# Altium schematic sheet Sheet1.SchDoc
size A4; SheetNumber: 1; SheetTotal: 1; SPICEModelCacheHBWIFJJK: <root> / <DocumentId>HBWIFJJK</DocumentId> / <CacheFrame Number="0"> / <Model Name="led0" Kind="MDL"> / <Text>*Typ INFRARED GaAs LED: Vf=1.2V Vr=5V If=40mA trr=3uS / *LED Pinout: 1=A, 2=K / .MODEL LED0 D (IS=93.5P RS=84M N=2.63 BV=5 IBV=10U / + CJO=2.97P VJ=.75 M=.333 TT=4.32U)</Text> / </Model> / </CacheFrame> / </root>
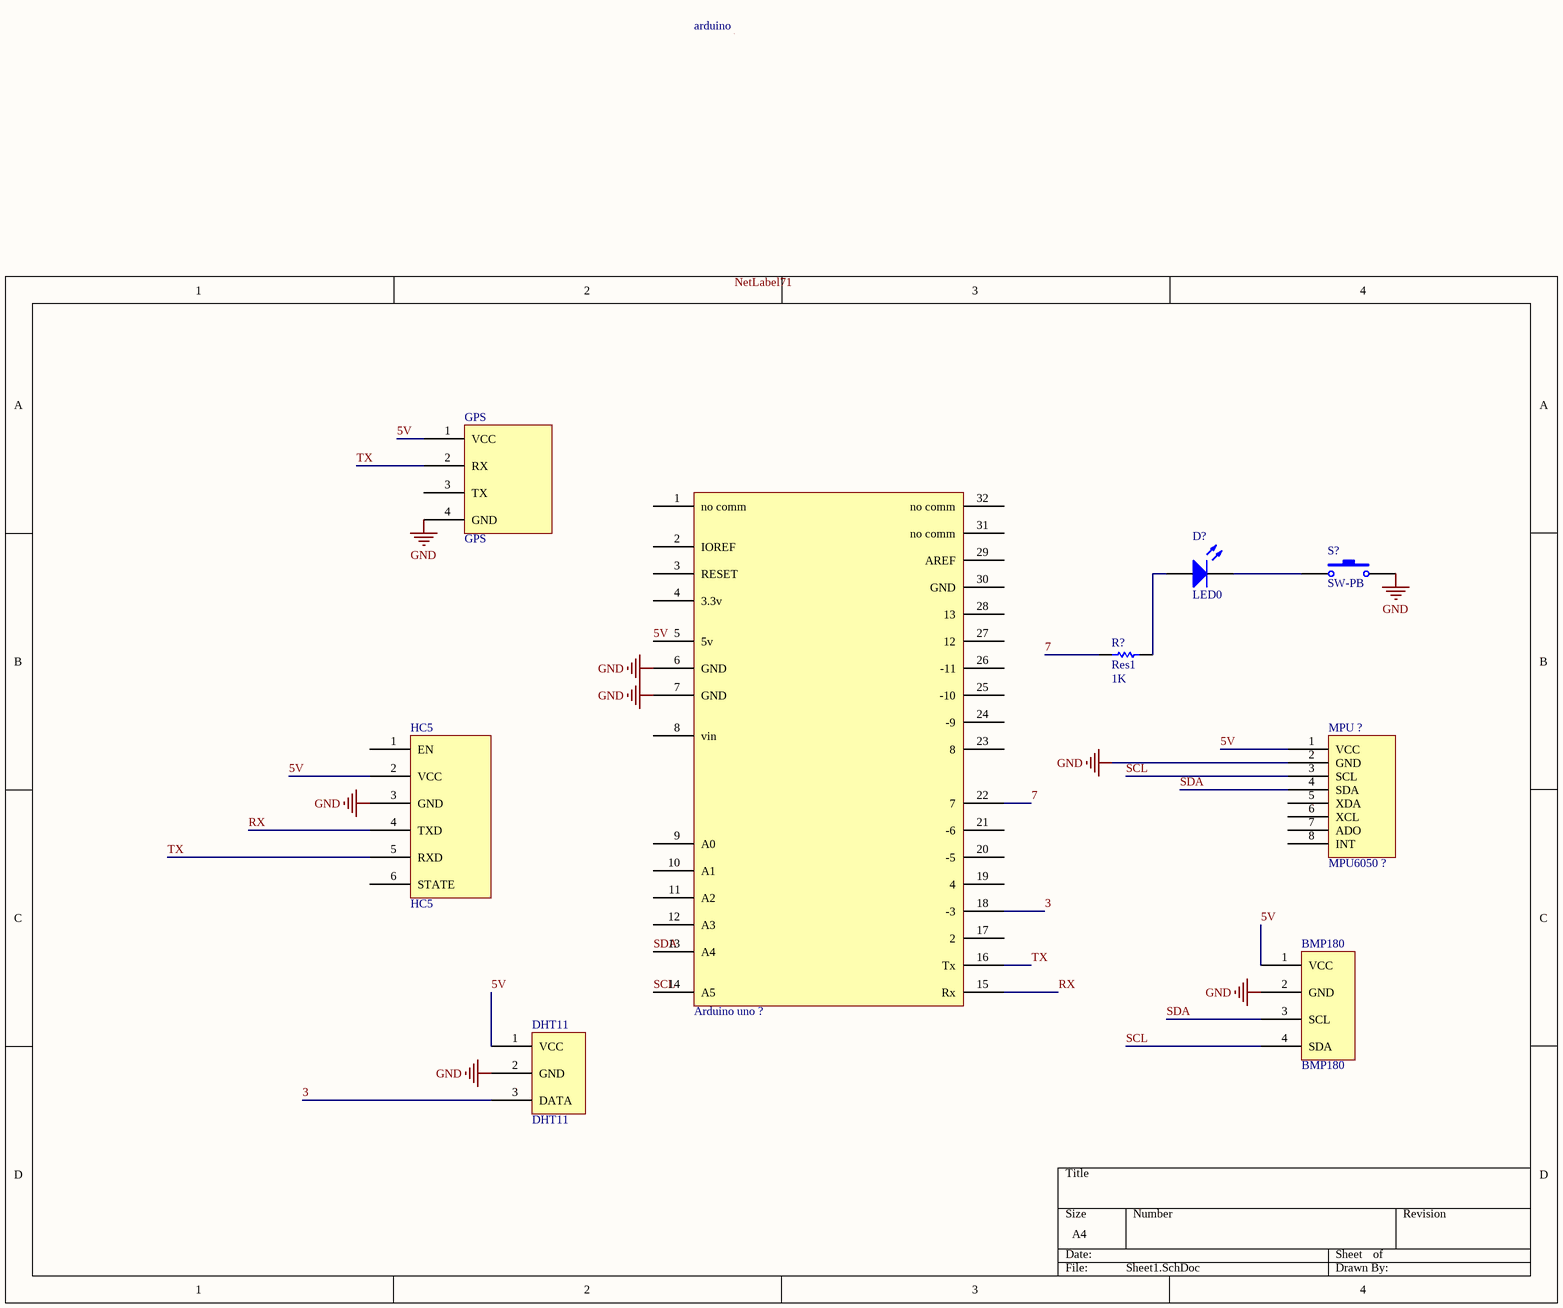
[diagram p0: Sheet1.SchDoc]

## Parts
arduino  Arduino uno ?  [ARD LIB]
BMP180  BMP180  [BMP280 - duplicate]
D?  LED0  [LED-0]
DHT11  DHT11  [DHT11]
GPS  GPS  [GPS - duplicate]
HC5  HC5  [HC5 - duplicate]
MPU_?  MPU6050 ?  [MPU pcb - duplicate]
R?  Res1  value 1K  [AXIAL-0.3]
S?  SW-PB  [SPST-2]

## Nets
GND: arduino.6(GND) arduino.7(GND) BMP180.2(GND) DHT11.2(GND) GPS.4(GND) HC5.3(GND) MPU_?.2(GND) S?.2
3: arduino.18(-3) DHT11.3(DATA)
5V: arduino.5(5v) BMP180.1(VCC) DHT11.1(VCC) GPS.1(VCC) HC5.2(VCC) MPU_?.1(VCC)
7: arduino.22(7) R?.1
RX: arduino.15(Rx) HC5.4(TXD)
SCL: arduino.14(A5) BMP180.4(SDA) MPU_?.3(SCL)
SDA: arduino.13(A4) BMP180.3(SCL) MPU_?.4(SDA)
TX: arduino.16(Tx) GPS.2(RX) HC5.5(RXD)
NetD?_1: D?.1(A) R?.2
NetD?_2: D?.2(K) S?.1

Not connected (* = marked no-connect by the designer): arduino 1(no_comm) 2(IOREF) 3(RESET) 4(3.3v) 8(vin) 9(A0) 10(A1) 11(A2) 12(A3) 17(2) 19(4) 20(-5) 21(-6) 23(8) 24(-9) 25(-10) 26(-11) 27(12) 28(13) 29(AREF) 30(GND) 31(no_comm) 32(no_comm); GPS 3(TX); HC5 1(EN) 6(STATE); MPU_? 5(XDA) 6(XCL) 7(ADO) 8(INT)

## Notes on the sheet
- Labels drawn without touching a wire or pin: NetLabel71

## Library data of the parts
BMP180 = BMP280
D? = LED0: Typical INFRARED GaAs LED; Published: 8-Jun-2000; LatestRevisionDate: 08-Jul-2005; LatestRevisionNote: Mech Layer 1 removed.; PackageReference: LED-0; Publisher: Altium Limited; PackageDescription: LED; 2 Leads
HC5 = HC12
R? = Res1: Resistor; Published: 8-Jun-2000; LatestRevisionDate: 17-Jul-2002; LatestRevisionNote: Re-released for DXP Platform.; PackageReference: AXIAL-0.3; Publisher: Altium Limited; PackageDescription: Axial Device, Thru-Hole; 2 Leads; 0.3 in Pin Spacing
S? = SW-PB: Switch; Published: 24-Mar-1999; LatestRevisionDate: 17-Jul-2002; LatestRevisionNote: Re-released for DXP Platform.; PackageReference: SPST-2; Publisher: Altium Limited; PackageDescription: Switch; 2 Leads
arduino = Arduino uno ?: Parameter 1: ARDUINO
MPU_? = MPU6050 ?: Parameter 1: MPU6050